# EAGLE design max7219 (EAGLE 6.1)
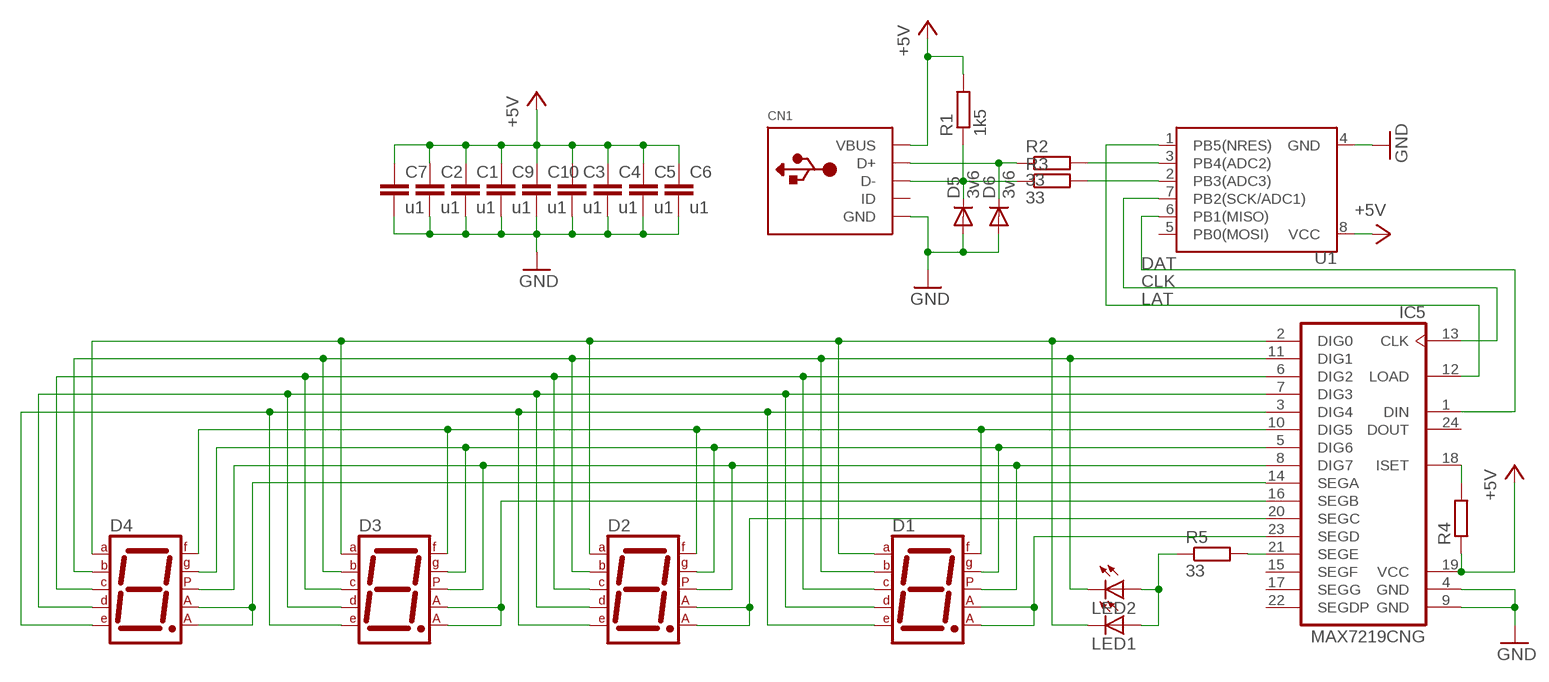
[diagram p0: schematic, sheet 1]

## Parts
C1  u1  C-EUC0805K  [C0805K]
C2  u1  C-EUC0805K  [C0805K]
C3  u1  C-EUC0805K  [C0805K]
C4  u1  C-EUC0805K  [C0805K]
C5  u1  C-EUC0805K  [C0805K]
C6  u1  C-EUC0805K  [C0805K]
C7  u1  C-EUC0805K  [C0805K]
C9  u1  C-EUC0805K  [C0805K]
C10  u1  C-EUC0805K  [C0805K]
CN1  USBTHM  [USB-MINIB-THM]
D1  7SEG-CA  [7SEG-13]
D2  7SEG-CA  [7SEG-13]
D3  7SEG-CA  [7SEG-13]
D4  7SEG-CA  [7SEG-13]
D5  3v6  DIODE-MINIMELF  [MINIMELF]
D6  3v6  DIODE-MINIMELF  [MINIMELF]
IC5  MAX7219CNG  [DIL24-3]
LED1  LED3MM  [LED3MM]
LED2  LED3MM  [LED3MM]
R1  1k5  R-EU_M0805  [M0805]
R2  33  R-EU_M0805  [M0805]
R3  33  R-EU_M0805  [M0805]
R4  R-EU_R0805  [R0805]
R5  33  R-EU_M0805  [M0805]
U1  ATTINY45ATTINYX5-20-DIP-GAP  [DIL08]

## Nets
+5V: C1.1 C2.1 C3.1 C4.1 C5.1 C6.1 C7.1 C9.1 C10.1 CN1.VBUS IC5.19(VCC) R1.2 R4.1 U1.8(VCC)
CLK: IC5.13(CLK) U1.7(PB2(SCK/ADC1))
DAT: IC5.1(DIN) U1.6(PB1(MISO))
GND: C1.2 C2.2 C3.2 C4.2 C5.2 C6.2 C7.2 C9.2 C10.2 CN1.GND D5.A D6.A IC5.4(GND) IC5.9(GND) U1.4(GND)
LAT: IC5.12(LOAD) U1.1(PB5(NRES))
N$1: D2.3(CA1) D2.8(CA2) IC5.20(SEGC)
N$2: D4.3(CA1) D4.8(CA2) IC5.14(SEGA)
N$3: D1.3(CA1) D1.8(CA2) IC5.23(SEGD)
N$4: LED1.A LED2.A R5.1
N$5: D1.7(A) D2.7(A) D3.7(A) D4.7(A) IC5.2(DIG0) LED1.K(C)
N$6: D1.6(B) D2.6(B) D3.6(B) D4.6(B) IC5.11(DIG1) LED2.K(C)
N$7: D1.4(C) D2.4(C) D3.4(C) D4.4(C) IC5.6(DIG2)
N$8: D1.2(D) D2.2(D) D3.2(D) D4.2(D) IC5.7(DIG3)
N$9: D1.1(E) D2.1(E) D3.1(E) D4.1(E) IC5.3(DIG4)
N$10: D1.9(F) D2.9(F) D3.9(F) D4.9(F) IC5.10(DIG5)
N$11: D1.10(G) D2.10(G) D3.10(G) D4.10(G) IC5.5(DIG6)
N$12: D1.5(DP) D2.5(DP) D3.5(DP) D4.5(DP) IC5.8(DIG7)
N$13: IC5.18(ISET) R4.2
N$14: D3.3(CA1) D3.8(CA2) IC5.16(SEGB)
N$15: IC5.21(SEGE) R5.2
N$46: R2.2 U1.3(PB4(ADC2))
N$47: CN1.D- D5.C R1.1 R3.1
N$48: CN1.D+ D6.C R2.1
N$49: R3.2 U1.2(PB3(ADC3))
Unconnected: CN1.ID IC5.15(SEGF) IC5.17(SEGG) IC5.22(SEGDP) IC5.24(DOUT) U1.5(PB0(MOSI))

## Library data of the parts
C1-C7 C9 C10 = rcl:C-EU: CAPACITOR, European symbol
CN1 = adafruit:USB: USB Connectors USBMINIB - Surface Mount Female Mini-B USB Connector 4UConnector: 06564 By microbuilder.eu Thru-hole RA Female Mini-B USB Connector 4UConnector: 18732 By ladyada.net
D1-D4 = special:7SEG-CA: 7-segment DISPLAY single anode, 13 mm
D5 D6 = diode:DIODE-: DIODE
IC5 = maxim:MAX7219CNG: LED DISPLAY DRIVER; MF: MAXIM; MPN: MAX7219CNG; OC_FARNELL: 1523914; OC_NEWARK: 34C4018
LED1 LED2 = led:LED: LED OSRAM: - CHIPLED LG R971, LG N971, LY N971, LG Q971, LY Q971, LO R971, LY R971 LH N974, LH R974 LS Q976, LO Q976, LY Q976 LO Q996 - Hyper CHIPLED LW Q18S LB Q993, LB Q99A, LB R99A - SideLED LS A670, LO A670, LY A670, LG A670, LP A670 LB A673, LV A673, LT A673, LW A673 LH A674 LY A675 LS A676, LA A676, LO A676, LY A676, LW A676 LS A679, LY A679, LG A679 - Hyper Micro SIDELED® LS Y876, LA Y876, LO Y876, LY Y876 LT Y87S - SmartLED LW L88C, LW L88S LB L89C, LB L89S, LG L890 LS L89K, LO L89K, LY L89K LS L896, LA L896, LO L896, LY L896 - TOPLED LS T670, LO T670, LY T670, LG T670, LP T670 LSG T670, LSP T670, LSY T670, LOP T670, LYG T670 LG T671, LOG T671, LSG T671 LB T673, LV T673, LT T673, LW T673 LH T674 LS T676, LA T676, LO T676, LY T676, LB T676, LH T676, LSB T676, LW T676 LB T67C, LV T67C, LT T67C, LS T67K, LO T67K, LY T67K, LW E67C LS E67B, LA E67B, LO E67B, LY E67B, LB E67C, LV E67C, LT E67C LW T67C LS T679, LY T679, LG T679 LS T770, LO T770, LY T770, LG T770, LP T770 LB T773, LV T773, LT T773, LW T773 LH T774 LS E675, LA E675, LY E675, LS T675 LS T776, LA T776, LO T776, LY T776, LB T776 LHGB T686 LT T68C, LB T68C - Hyper Mini TOPLED® LB M676 - Mini TOPLED Santana® LG M470 LS M47K, LO M47K, LY M47K Source: http://www.osram.convergy.de LUXEON: - LUMILED® LXK2-PW12-R00, LXK2-PW12-S00, LXK2-PW14-U00, LXK2-PW14-V00 LXK2-PM12-R00, LXK2-PM12-S00, LXK2-PM14-U00 LXK2-PE12-Q00, LXK2-PE12-R00, LXK2-PE12-S00, LXK2-PE14-T00, LXK2-PE14-U00 LXK2-PB12-K00, LXK2-PB12-L00, LXK2-PB12-M00, LXK2-PB14-N00, LXK2-PB14-P00, LXK2-PB14-Q00 LXK2-PR12-L00, LXK2-PR12-M00, LXK2-PR14-Q00, LXK2-PR14-R00 LXK2-PD12-Q00, LXK2-PD12-R00, LXK2-PD12-S00 LXK2-PH12-R00, LXK2-PH12-S00 LXK2-PL12-P00, LXK2-PL12-Q00, LXK2-PL12-R00 Source: www.luxeon.com KINGBRIGHT: KA-3528ASYC Source: www.kingbright.com
R1-R5 = rcl:R-EU_: RESISTOR, European symbol
U1 = _MY_OWN_LIB:ATTINY45: Atmel 8-pin 2/4/8kB flash uC

## Board
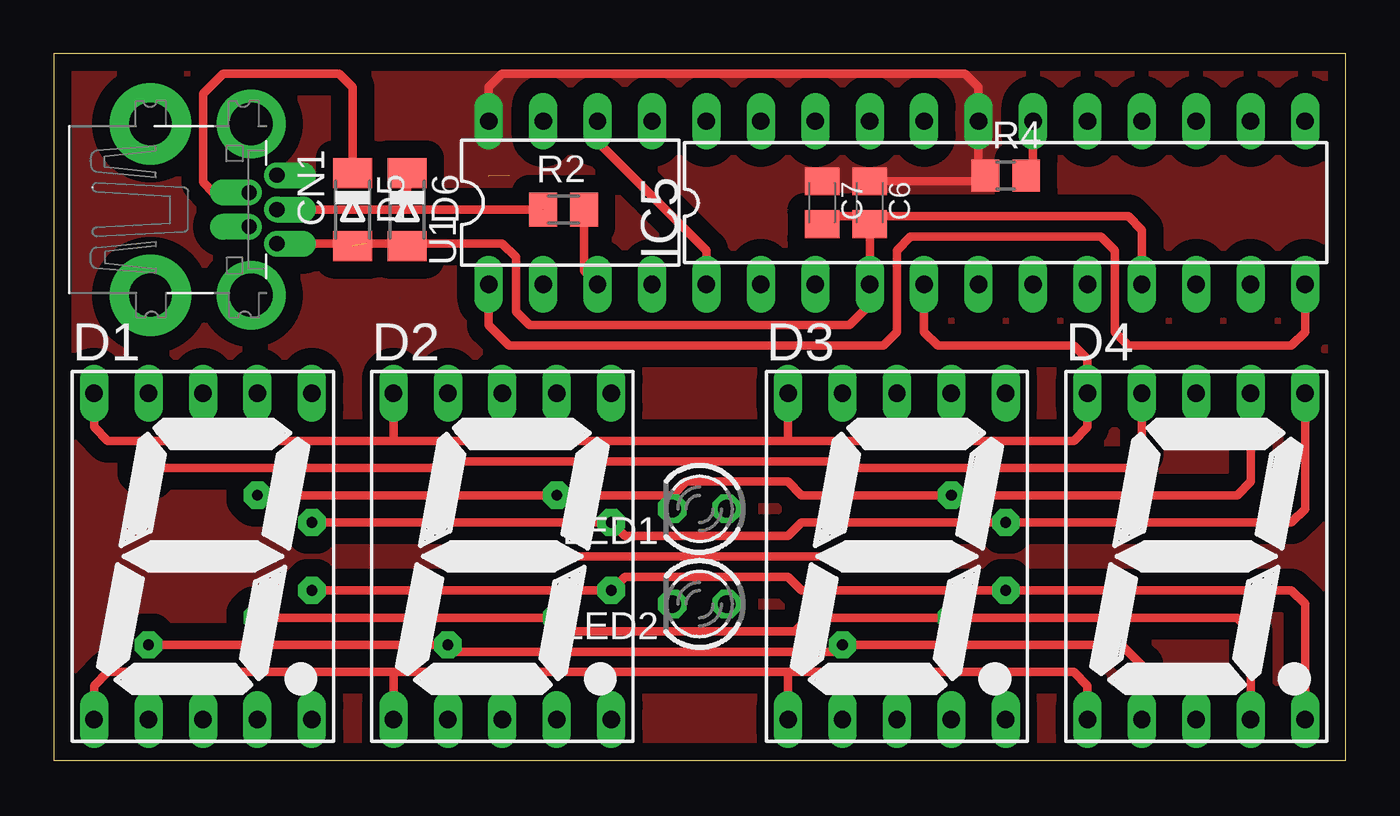
[diagram p1: board, top side]
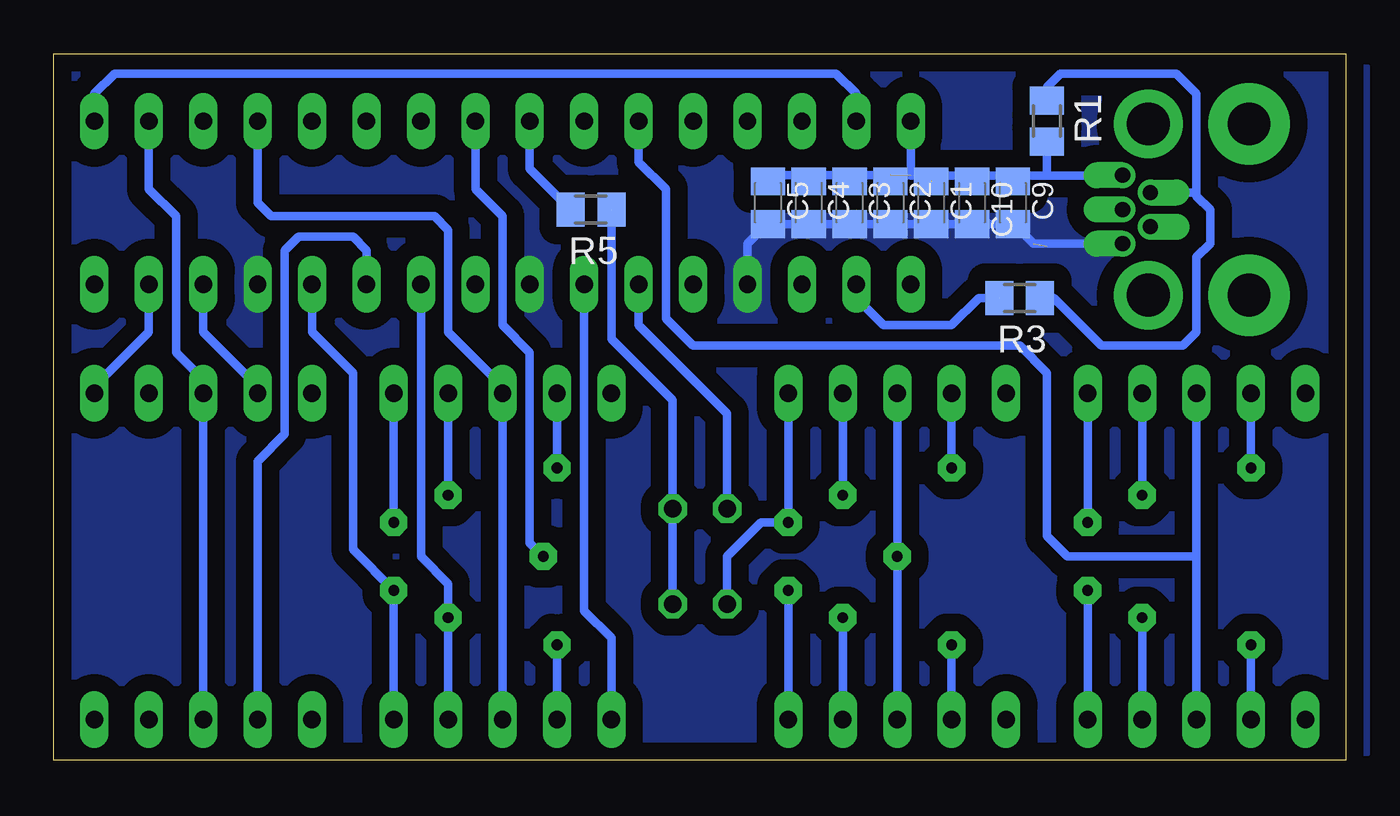
[diagram p2: board, bottom side, seen from below]

Size 60.31 x 33 mm. Coordinates in mm from the lower left corner, seen from the top.
Outline: 60.31,0 60.31,33 0,33 0,0 60.31,0
Copper layers (1*16): Top 0.035mm / dielectric 1.5mm / Bottom 0.035mm
Design rules: minimum track width 10mil, minimum drill 24mil, track to track 12mil, track to pad 12mil, pad to pad 12mil, via to via 12mil, smd to smd 10mil, copper to edge 12mil, drill to drill 12mil, minimum pad ring 10mil, minimum via ring 10mil, stop-mask expansion 4mil, vias tented up to drill 0mil, thermal gap 12mil

### Footprints (pad centres in the part's own frame; a part is rotated, then mirrored left to right if it is on the bottom)
C0805K = smd 1.3 x 1.6: 1 -1,0; 2 1,0
USB-MINIB-THM = drill 0.7 offset: D+ 0,9.8; D- -0.8,8.5; GND 1.6,9.8; ID 0.8,8.5; VBUS -1.6,9.8 | drill 2 pad 3.81: GND1 -4,3.9; GND4 4,3.9 | drill 2 pad 3.2: GND2 -4,8.6; GND3 4,8.6
7SEG-13 = drill 0.813 long: 1 -5.08,-7.62; 2 -2.54,-7.62; 3 0,-7.62; 4 2.54,-7.62; 5 5.08,-7.62; 6 5.08,7.62; 7 2.54,7.62; 8 0,7.62; 9 -2.54,7.62; 10 -5.08,7.62
MINIMELF = smd 1.4 x 1.8: A 1.7,0; C -1.7,0
DIL24-3 = drill 0.813 long: 1 -13.97,-3.81; 2 -11.43,-3.81; 3 -8.89,-3.81; 4 -6.35,-3.81; 5 -3.81,-3.81; 6 -1.27,-3.81; 7 1.27,-3.81; 8 3.81,-3.81; 9 6.35,-3.81; 10 8.89,-3.81; 11 11.43,-3.81; 12 13.97,-3.81; 13 13.97,3.81; 14 11.43,3.81; 15 8.89,3.81; 16 6.35,3.81; 17 3.81,3.81; 18 1.27,3.81; 19 -1.27,3.81; 20 -3.81,3.81; 21 -6.35,3.81; 22 -8.89,3.81; 23 -11.43,3.81; 24 -13.97,3.81
LED3MM = drill 0.813 octagon: A -1.27,0; K 1.27,0
M0805 = smd 1.3 x 1.6: 1 -0.95,0; 2 0.95,0
R0805 = smd 1.3 x 1.5: 1 -0.95,0; 2 0.95,0
DIL08 = drill 0.813 long: 1 -3.81,-3.81; 2 -1.27,-3.81; 3 1.27,-3.81; 4 3.81,-3.81; 5 3.81,3.81; 6 1.27,3.81; 7 -1.27,3.81; 8 -3.81,3.81

### Placement (x,y rotation side)
C1  19.36,26.04 270 bottom
C2  21.26,26.04 270 bottom
C3  23.16,26.04 270 bottom
C4  25.07,26.04 270 bottom
C5  26.98,26.04 270 bottom
C6  38.09,26.04 270 top
C7  35.86,26.04 270 top
C9  15.54,26.04 270 bottom
C10  17.45,26.04 270 bottom
CN1  0.62,25.72 270 top
D1  6.97,9.53 0 top
D2  20.94,9.53 0 top
D3  39.36,9.53 0 top
D4  53.33,9.53 0 top
D5  13.96,25.72 270 top
D6  16.5,25.72 270 top
IC5  44.44,26.04 0 top
LED1  30.15,11.75 180 top
LED2  30.15,7.3 180 top
R1  13.96,29.84 270 bottom
R2  23.8,25.72 0 top
R3  15.23,21.59 180 bottom
R4  44.44,27.3 0 top
R5  35.23,25.72 180 bottom
U1  24.12,26.04 0 top

### Tracks (layer width: path | path; a pad name or v marks a point on that pad's centre or on a via)
+5V  (2 unrouted)
  Top 0.406: U1.8 20.31,31.43 20.94,32.07 42.53,32.07 43.17,31.43 IC5.19 43.17,27.62 | 43.17,27.62 R4.1 | C6.1 43.12,27.04 | 43.12,27.04 43.17,26.99 | 43.17,27.62 43.17,27.08 43.12,27.04
  Bottom 0.406: C9.1 15.54,27.3 13.96,27.3 | 23.16,27.32 21.26,27.32 | 21.26,27.32 19.32,27.32 19.32,27.02 19.35,26.99 | C9.1 15.82,27.3 17.45,27.3 C10.1 17.72,27.3 20.31,27.3 U1.8 | 23.16,27.32 25.07,27.32 | 25.07,27.32 26.96,27.32 26.98,27.3 C5.1 | C4.1 25.07,27.32 | C3.1 23.16,27.32 | CN1.VBUS 10.45,27.32 10.46,27.3 13.96,27.3 | C9.1 15.54,26.99 | R1.2 13.96,27.3 | C2.1 21.26,27.32
  pour Top (isolate 0.813, no thermals): 0.62,0.32 59.68,0.32 59.68,32.38 0.62,32.38
CLK
  Bottom 0.406: IC5.13 58.41,31.11 57.46,32.07 23.8,32.07 22.85,31.11 U1.7
DAT
  Top 0.406: IC5.1 30.47,23.81 25.39,28.89 U1.6
GND  (1 unrouted)
  Top 0.406: IC5.9 50.79,24.77 50.15,25.4 38.09,25.4 | 38.09,25.4 C6.2 IC5.4 38.09,21.27 37.14,20.32 22.21,20.32 21.58,20.95 21.58,23.5 20.94,24.13 20.3,24.12 16.4,24.12 | 38.09,25.4 35.86,25.4 C7.2 | CN1.GND 16.4,24.12 | 16.4,24.12 D6.A
  Bottom 0.406: C9.2 15.5,25.04 | C9.2 C10.2 C1.2 C2.2 C3.2 C4.2 | C4.2 C5.2 | U1.4 27.93,24.13 27.02,25.04 C4.2 | 10.46,24.13 14.59,24.13 15.54,25.08 C9.2
  pour Bottom (isolate 0.813, no thermals): -0.96,0.32 59.68,0.32 59.68,32.38 -0.96,32.38
LAT
  Top 0.406: U1.1 20.31,20.32 21.26,19.37 38.72,19.37 39.36,20 39.36,23.81 39.99,24.45 48.88,24.45 49.52,23.81 49.52,20 50.15,19.37 57.77,19.37 58.41,20 IC5.12
N$1  (via drill 0.5 pad 1.27)
  Top 0.406: v37.45,9.53 v20.94,9.53
  Bottom 0.406: D2.3 v20.94,9.53 D2.8 | IC5.20 40.63,26.67 39.36,25.4 39.36,20.32 38.09,19.05 38.09,10.16 v37.45,9.53
N$2
  Bottom 0.406: D4.3 D4.8 53.33,17.78 54.6,19.05 54.6,25.4 55.87,26.67 IC5.14
N$3
  Bottom 0.406: IC5.23 33.01,27.94 31.74,26.67 31.74,20.64 30.47,19.37 15.23,19.37 13.96,18.1 13.96,10.48 13.01,9.53 6.97,9.53 | D1.8 6.97,9.53 | 6.97,9.53 D1.3
N$4  (1 unrouted)
  Bottom 0.406: LED2.A LED1.A 31.42,16.83 34.28,19.68 R5.1
N$5  (via drill 0.5 pad 1.27)
  Top 0.406: v9.51,12.38 v23.48,12.38 28.88,12.38 | D4.7 55.87,13.02 55.23,12.38 v41.9,12.38 34.91,12.38 34.28,13.02 29.51,13.02 28.88,12.38 | LED1.K 28.88,12.38
  Bottom 0.406: D1.7 v9.51,12.38 | D2.7 v23.48,12.38 | D3.7 v41.9,12.38 | IC5.2 33.01,20.32 28.88,16.19 LED1.K
N$6  (via drill 0.5 pad 1.27)
  Top 0.406: v12.05,11.11 v26.02,11.11 26.66,10.48 34.28,10.48 34.91,11.11 v44.44,11.11 57.77,11.11 58.41,11.75 D4.6
  Bottom 0.406: D1.6 v12.05,11.11 | D2.6 v26.02,11.11 27.29,11.11 28.88,9.53 LED2.K | D3.6 v44.44,11.11 | D4.6 58.41,17.46 55.87,20 IC5.11
N$7  (via drill 0.5 pad 1.27)
  Top 0.406: v9.51,6.67 v23.48,6.67 24.12,6.03 34.6,6.03 35.23,6.67 v41.9,6.67 55.23,6.67 55.87,6.03 D4.4
  Bottom 0.406: D1.4 v9.51,6.67 | D2.4 v23.48,6.67 | D3.4 v41.9,6.67 41.9,8.26 43.17,9.53 IC5.6
N$8  (via drill 0.5 pad 1.27)
  Top 0.406: v4.43,5.4 v18.4,5.4 18.72,5.08 36.5,5.08 v36.82,5.4 49.83,5.4 50.79,4.45 D4.2
  Bottom 0.406: D1.2 v4.43,5.4 | D2.2 v18.4,5.4 | D3.2 v36.82,5.4 | D4.2 50.79,13.97 49.52,15.24 49.52,23.81 48.88,24.45 46.34,24.45 45.71,23.81 IC5.7
N$9
  Top 0.406: 15.86,4.13 34.28,4.13 | D2.1 15.86,4.13 | D3.1 34.28,4.13 | 34.28,4.13 47.61,4.13 48.25,3.49 D4.1 | 15.86,4.13 2.53,4.13 1.89,3.49 D1.1
  Bottom 0.406: IC5.3 35.55,6.99 34.28,5.71 D3.1
N$10  (via drill 0.5 pad 1.27)
  Top 0.406: D4.9 50.79,14.29 50.15,13.65 v36.82,13.65 36.5,13.97 18.72,13.97 v18.4,13.65 v4.43,13.65
  Bottom 0.406: D3.9 v36.82,13.65 | D4.9 50.79,17.46 53.33,20 IC5.10 | D2.9 v18.4,13.65 | v4.43,13.65 D1.9
N$11
  Top 0.406: 15.86,14.92 2.53,14.92 1.89,15.56 D1.10 | 15.86,14.92 34.28,14.92 | D2.10 15.86,14.92 | 34.28,14.92 47.61,14.92 48.25,15.56 D4.10 48.25,18.73 47.61,19.37 41.26,19.37 40.63,20 IC5.5 | D3.10 34.28,14.92
N$12  (via drill 0.5 pad 1.27)
  Top 0.406: v12.05,7.94 v26.02,7.94 26.66,8.57 34.28,8.57 34.91,7.94 v44.44,7.94 57.77,7.94 58.41,7.3 D4.5
  Bottom 0.406: D1.5 v12.05,7.94 | v26.02,7.94 D2.5 | D3.5 v44.44,7.94 46.34,9.84 46.34,18.1 48.25,20 IC5.8
N$13
  Top 0.406: IC5.18 45.71,27.62 R4.2
N$14
  Bottom 0.406: D3.3 D3.8 39.36,17.46 41.9,20 41.9,24.77 42.53,25.4 50.15,25.4 50.79,26.04 IC5.16
N$15
  Bottom 0.406: R5.2 38.09,27.62 IC5.21
N$46
  Top 0.406: R2.2 24.75,22.86 U1.3
N$47
  Top 0.406: D5.C 13.96,31.43 13.32,32.07 7.93,32.07 6.97,31.11 6.97,26.99 7.44,26.52 CN1.D-
  Bottom 0.406: R1.1 13.96,31.43 13.32,32.07 7.93,32.07 6.97,31.11 6.97,26.52 | CN1.D- 6.97,26.52 | R3.1 13.64,21.59 11.42,19.37 7.61,19.37 6.97,20 6.97,23.5 6.34,24.13 6.34,25.72 6.97,26.35 6.97,26.52
N$48  (1 unrouted)
  Top 0.406: CN1.D+ 16.5,25.72 | D6.C 16.5,25.72 | 16.5,25.72 R2.1
N$49  (1 unrouted)
  Bottom 0.406: R3.2 17.13,21.59 18.4,20.32 21.58,20.32 22.85,21.59 U1.2